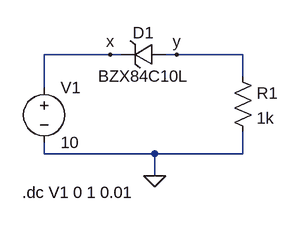
[diagram p0: schematic Zener diode reverse biased.asc]
Zener diode reverse biased.asc, the LTspice schematic file:
Version 4
SHEET 1 880 680
WIRE 224 64 128 64
WIRE 240 64 224 64
WIRE 320 64 304 64
WIRE 416 64 320 64
WIRE 416 96 416 64
WIRE 128 112 128 64
WIRE 128 208 128 192
WIRE 288 208 128 208
WIRE 416 208 416 176
WIRE 416 208 288 208
WIRE 288 240 288 208
FLAG 288 240 0
FLAG 224 64 x
FLAG 320 64 y
SYMBOL voltage 128 96 R0
WINDOW 123 0 0 Left 0
WINDOW 39 0 0 Left 0
SYMATTR InstName V1
SYMATTR Value 10
SYMBOL zener 304 48 R90
WINDOW 0 0 32 VBottom 2
WINDOW 3 32 32 VTop 2
SYMATTR InstName D1
SYMATTR Value BZX84C10L
SYMATTR Description Diode
SYMATTR Type diode
SYMBOL res 400 80 R0
SYMATTR InstName R1
SYMATTR Value 1k
TEXT 96 264 Left 2 !.dc V1 0 1 0.01

The netlist it stands for:
* Zener diode reverse biased.asc
V1 x 0 10
D1 y x BZX84C10L
R1 y 0 1k
.model D D
.lib standard.dio
.dc V1 0 1 0.01
.backanno
.end